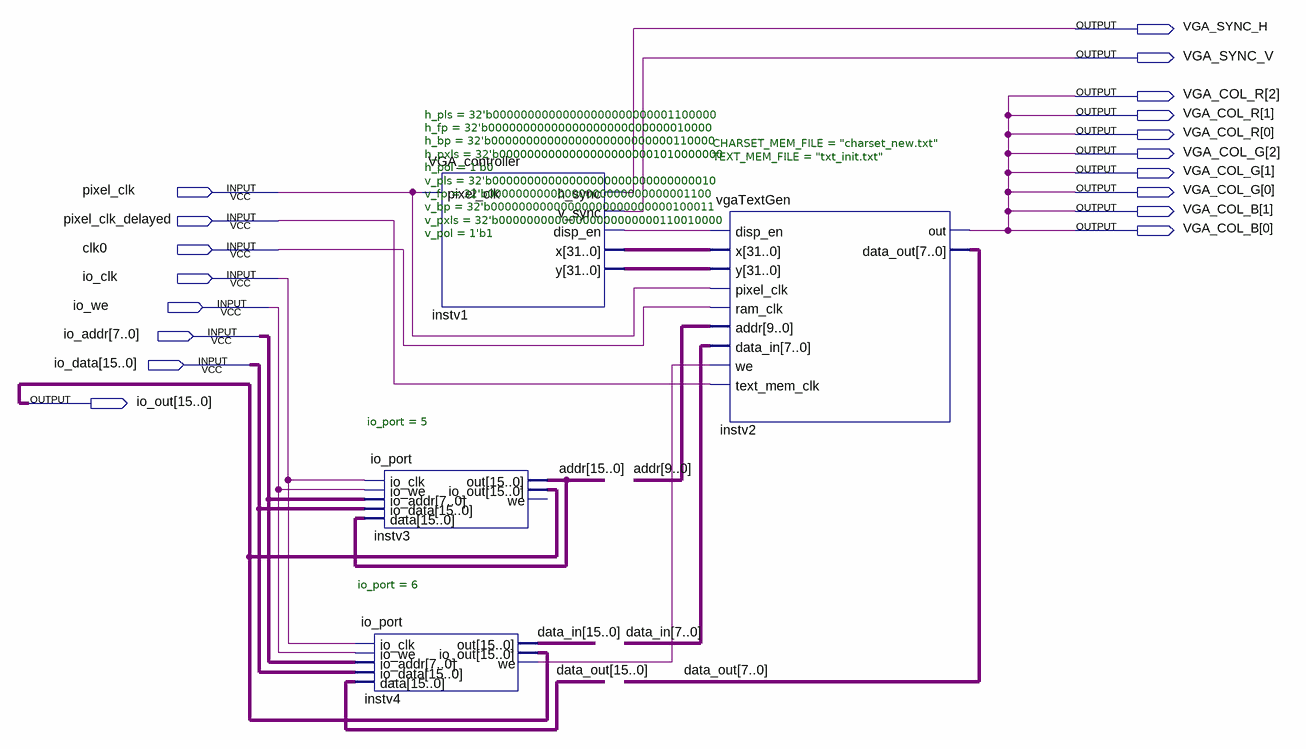
[diagram p0: schematic sheet]
// Quartus schematic vga_io.bdf as structural Verilog: 4 symbols, 18 pins
module vga_io (
  input  pixel_clk,
  input  pixel_clk_delayed,
  input  clk0,
  input  io_clk,
  input  io_we,
  input  [7:0] io_addr,
  input  [15:0] io_data,
  output VGA_SYNC_H,
  output VGA_SYNC_V,
  output [2:0] VGA_COL_R,
  output [2:0] VGA_COL_G,
  output [1:0] VGA_COL_B,
  output [15:0] io_out
);

  wire instv1_disp_en, instv4_we;
  wire [15:0] addr, data_in, data_out;
  wire [31:0] instv1_x, instv1_y;

  VGA_controller #(.h_pls(32'b00000000000000000000000001100000), .h_fp(32'b00000000000000000000000000010000), .h_bp(32'b00000000000000000000000000110000), .h_pxls(32'b00000000000000000000001010000000), .h_pol(1'b0), .v_pls(32'b00000000000000000000000000000010), .v_fp(32'b00000000000000000000000000001100), .v_bp(32'b00000000000000000000000000100011), .v_pxls(32'b00000000000000000000000110010000), .v_pol(1'b1)) instv1 (
    .pixel_clk(pixel_clk), .h_sync(VGA_SYNC_H), .v_sync(VGA_SYNC_V), .disp_en(instv1_disp_en), .x(instv1_x),
    .y(instv1_y));
  io_port #(.io_port(5)) instv3 (
    .io_clk(io_clk), .io_we(io_we), .io_addr(io_addr), .io_data(io_data), .data(addr), .out(addr),
    .io_out(io_out));  // open: we
  io_port #(.io_port(6)) instv4 (
    .io_clk(io_clk), .io_we(io_we), .io_addr(io_addr), .io_data(io_data), .data(data_out), .out(data_in),
    .io_out(io_out), .we(instv4_we));
  vgaTextGen #(.CHARSET_MEM_FILE("charset_new.txt"), .TEXT_MEM_FILE("txt_init.txt")) instv2 (
    .disp_en(instv1_disp_en), .x(instv1_x), .y(instv1_y), .pixel_clk(pixel_clk), .ram_clk(clk0),
    .addr(addr[9:0]), .data_in(data_in[7:0]), .we(instv4_we), .text_mem_clk(pixel_clk_delayed),
    .out(VGA_COL_B[1]), .data_out(data_out[7:0]));

  assign VGA_COL_B[0] = VGA_COL_B[1];
  assign VGA_COL_G = {3{VGA_COL_B[1]}};
  assign VGA_COL_R = {3{VGA_COL_B[1]}};
endmodule
